# EAGLE schematic DipSeq_panel_20150406 (EAGLE 7.1.0)
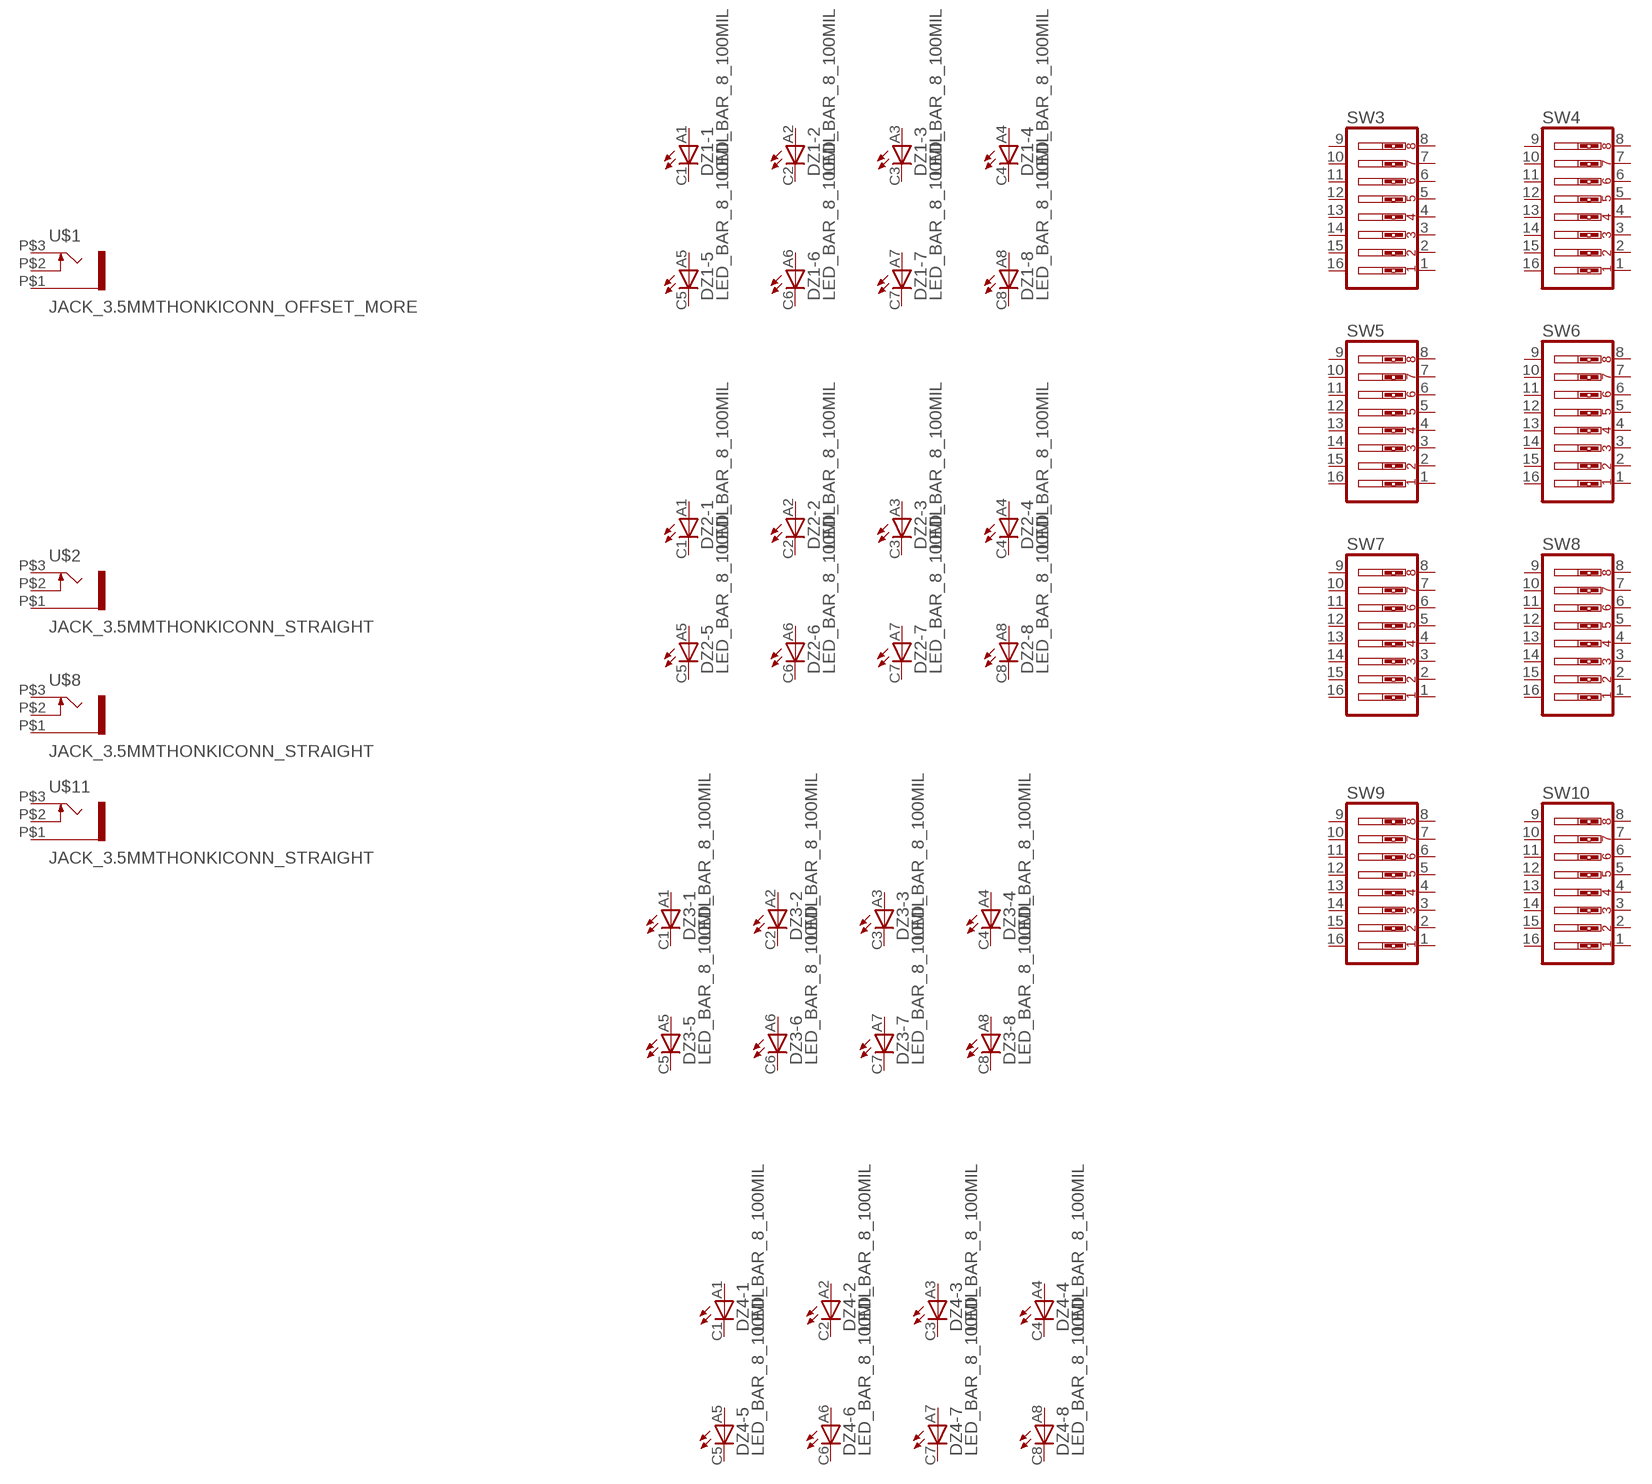
[diagram p0: schematic, sheet 1]

## Parts
DZ1  LED_BAR_8_100MIL  [LED_BAR_8]
DZ2  LED_BAR_8_100MIL  [LED_BAR_8]
DZ3  LED_BAR_8_100MIL  [LED_BAR_8]
DZ4  LED_BAR_8_100MIL  [LED_BAR_8]
SW3  SW_DIP-8PIANO_STYLE  [PIANO_DIPSWITCH_08]
SW4  SW_DIP-8PIANO_STYLE  [PIANO_DIPSWITCH_08]
SW5  SW_DIP-8PIANO_STYLE  [PIANO_DIPSWITCH_08]
SW6  SW_DIP-8PIANO_STYLE  [PIANO_DIPSWITCH_08]
SW7  SW_DIP-8PIANO_STYLE  [PIANO_DIPSWITCH_08]
SW8  SW_DIP-8PIANO_STYLE  [PIANO_DIPSWITCH_08]
SW9  SW_DIP-8PIANO_STYLE  [PIANO_DIPSWITCH_08]
SW10  SW_DIP-8PIANO_STYLE  [PIANO_DIPSWITCH_08]
U$1  JACK_3.5MMTHONKICONN_OFFSET_MORE  [THONKICONN_LAYOUT_3]
U$2  JACK_3.5MMTHONKICONN_STRAIGHT  [THONKICONN_LAYOUT]
U$8  JACK_3.5MMTHONKICONN_STRAIGHT  [THONKICONN_LAYOUT]
U$11  JACK_3.5MMTHONKICONN_STRAIGHT  [THONKICONN_LAYOUT]
Unconnected: DZ1.A1(-1:A) DZ1.A2(-2:A) DZ1.A3(-3:A) DZ1.A4(-4:A) DZ1.A5(-5:A) DZ1.A6(-6:A) DZ1.A7(-7:A) DZ1.A8(-8:A) DZ1.C1(-1:C) DZ1.C2(-2:C) DZ1.C3(-3:C) DZ1.C4(-4:C) DZ1.C5(-5:C) DZ1.C6(-6:C) DZ1.C7(-7:C) DZ1.C8(-8:C) DZ2.A1(-1:A) DZ2.A2(-2:A) DZ2.A3(-3:A) DZ2.A4(-4:A) DZ2.A5(-5:A) DZ2.A6(-6:A) DZ2.A7(-7:A) DZ2.A8(-8:A) DZ2.C1(-1:C) DZ2.C2(-2:C) DZ2.C3(-3:C) DZ2.C4(-4:C) DZ2.C5(-5:C) DZ2.C6(-6:C) DZ2.C7(-7:C) DZ2.C8(-8:C) DZ3.A1(-1:A) DZ3.A2(-2:A) DZ3.A3(-3:A) DZ3.A4(-4:A) DZ3.A5(-5:A) DZ3.A6(-6:A) DZ3.A7(-7:A) DZ3.A8(-8:A) DZ3.C1(-1:C) DZ3.C2(-2:C) DZ3.C3(-3:C) DZ3.C4(-4:C) DZ3.C5(-5:C) DZ3.C6(-6:C) DZ3.C7(-7:C) DZ3.C8(-8:C) DZ4.A1(-1:A) DZ4.A2(-2:A) DZ4.A3(-3:A) DZ4.A4(-4:A) DZ4.A5(-5:A) DZ4.A6(-6:A) DZ4.A7(-7:A) DZ4.A8(-8:A) DZ4.C1(-1:C) DZ4.C2(-2:C) DZ4.C3(-3:C) DZ4.C4(-4:C) DZ4.C5(-5:C) DZ4.C6(-6:C) DZ4.C7(-7:C) DZ4.C8(-8:C) SW3.1 SW3.2 SW3.3 SW3.4 SW3.5 SW3.6 SW3.7 SW3.8 SW3.9 SW3.10 SW3.11 SW3.12 SW3.13 SW3.14 SW3.15 SW3.16 SW4.1 SW4.2 SW4.3 SW4.4 SW4.5 SW4.6 SW4.7 SW4.8 SW4.9 SW4.10 SW4.11 SW4.12 SW4.13 SW4.14 SW4.15 SW4.16 SW5.1 SW5.2 SW5.3 SW5.4 SW5.5 SW5.6 SW5.7 SW5.8 SW5.9 SW5.10 SW5.11 SW5.12 SW5.13 SW5.14 SW5.15 SW5.16 SW6.1 SW6.2 SW6.3 SW6.4 SW6.5 SW6.6 SW6.7 SW6.8 SW6.9 SW6.10 SW6.11 SW6.12 SW6.13 SW6.14 SW6.15 SW6.16 SW7.1 SW7.2 SW7.3 SW7.4 SW7.5 SW7.6 SW7.7 SW7.8 SW7.9 SW7.10 SW7.11 SW7.12 SW7.13 SW7.14 SW7.15 SW7.16 SW8.1 SW8.2 SW8.3 SW8.4 SW8.5 SW8.6 SW8.7 SW8.8 SW8.9 SW8.10 SW8.11 SW8.12 SW8.13 SW8.14 SW8.15 SW8.16 SW9.1 SW9.2 SW9.3 SW9.4 SW9.5 SW9.6 SW9.7 SW9.8 SW9.9 SW9.10 SW9.11 SW9.12 SW9.13 SW9.14 SW9.15 SW9.16 SW10.1 SW10.2 SW10.3 SW10.4 SW10.5 SW10.6 SW10.7 SW10.8 SW10.9 SW10.10 SW10.11 SW10.12 SW10.13 SW10.14 SW10.15 SW10.16 U$1.P$1(SLEEVE) U$1.P$2(SWITCH) U$1.P$3(TIP) U$2.P$1(SLEEVE) U$2.P$2(SWITCH) U$2.P$3(TIP) U$8.P$1(SLEEVE) U$8.P$2(SWITCH) U$8.P$3(TIP) U$11.P$1(SLEEVE) U$11.P$2(SWITCH) U$11.P$3(TIP)

## Library data of the parts
DZ1-DZ4 = amdagan:LED_BAR_8_100MIL: LED BLOCK 8-LED bar graph, DIL Dealextreme SKU 307214
SW3-SW10 = amdagan:SW_DIP-8: DIP SWITCH
U$1 U$2 U$8 U$11 = amdagan:JACK_3.5MM